# Altium schematic sheet 船主控原理图.schdoc
size 562 x 403 mm
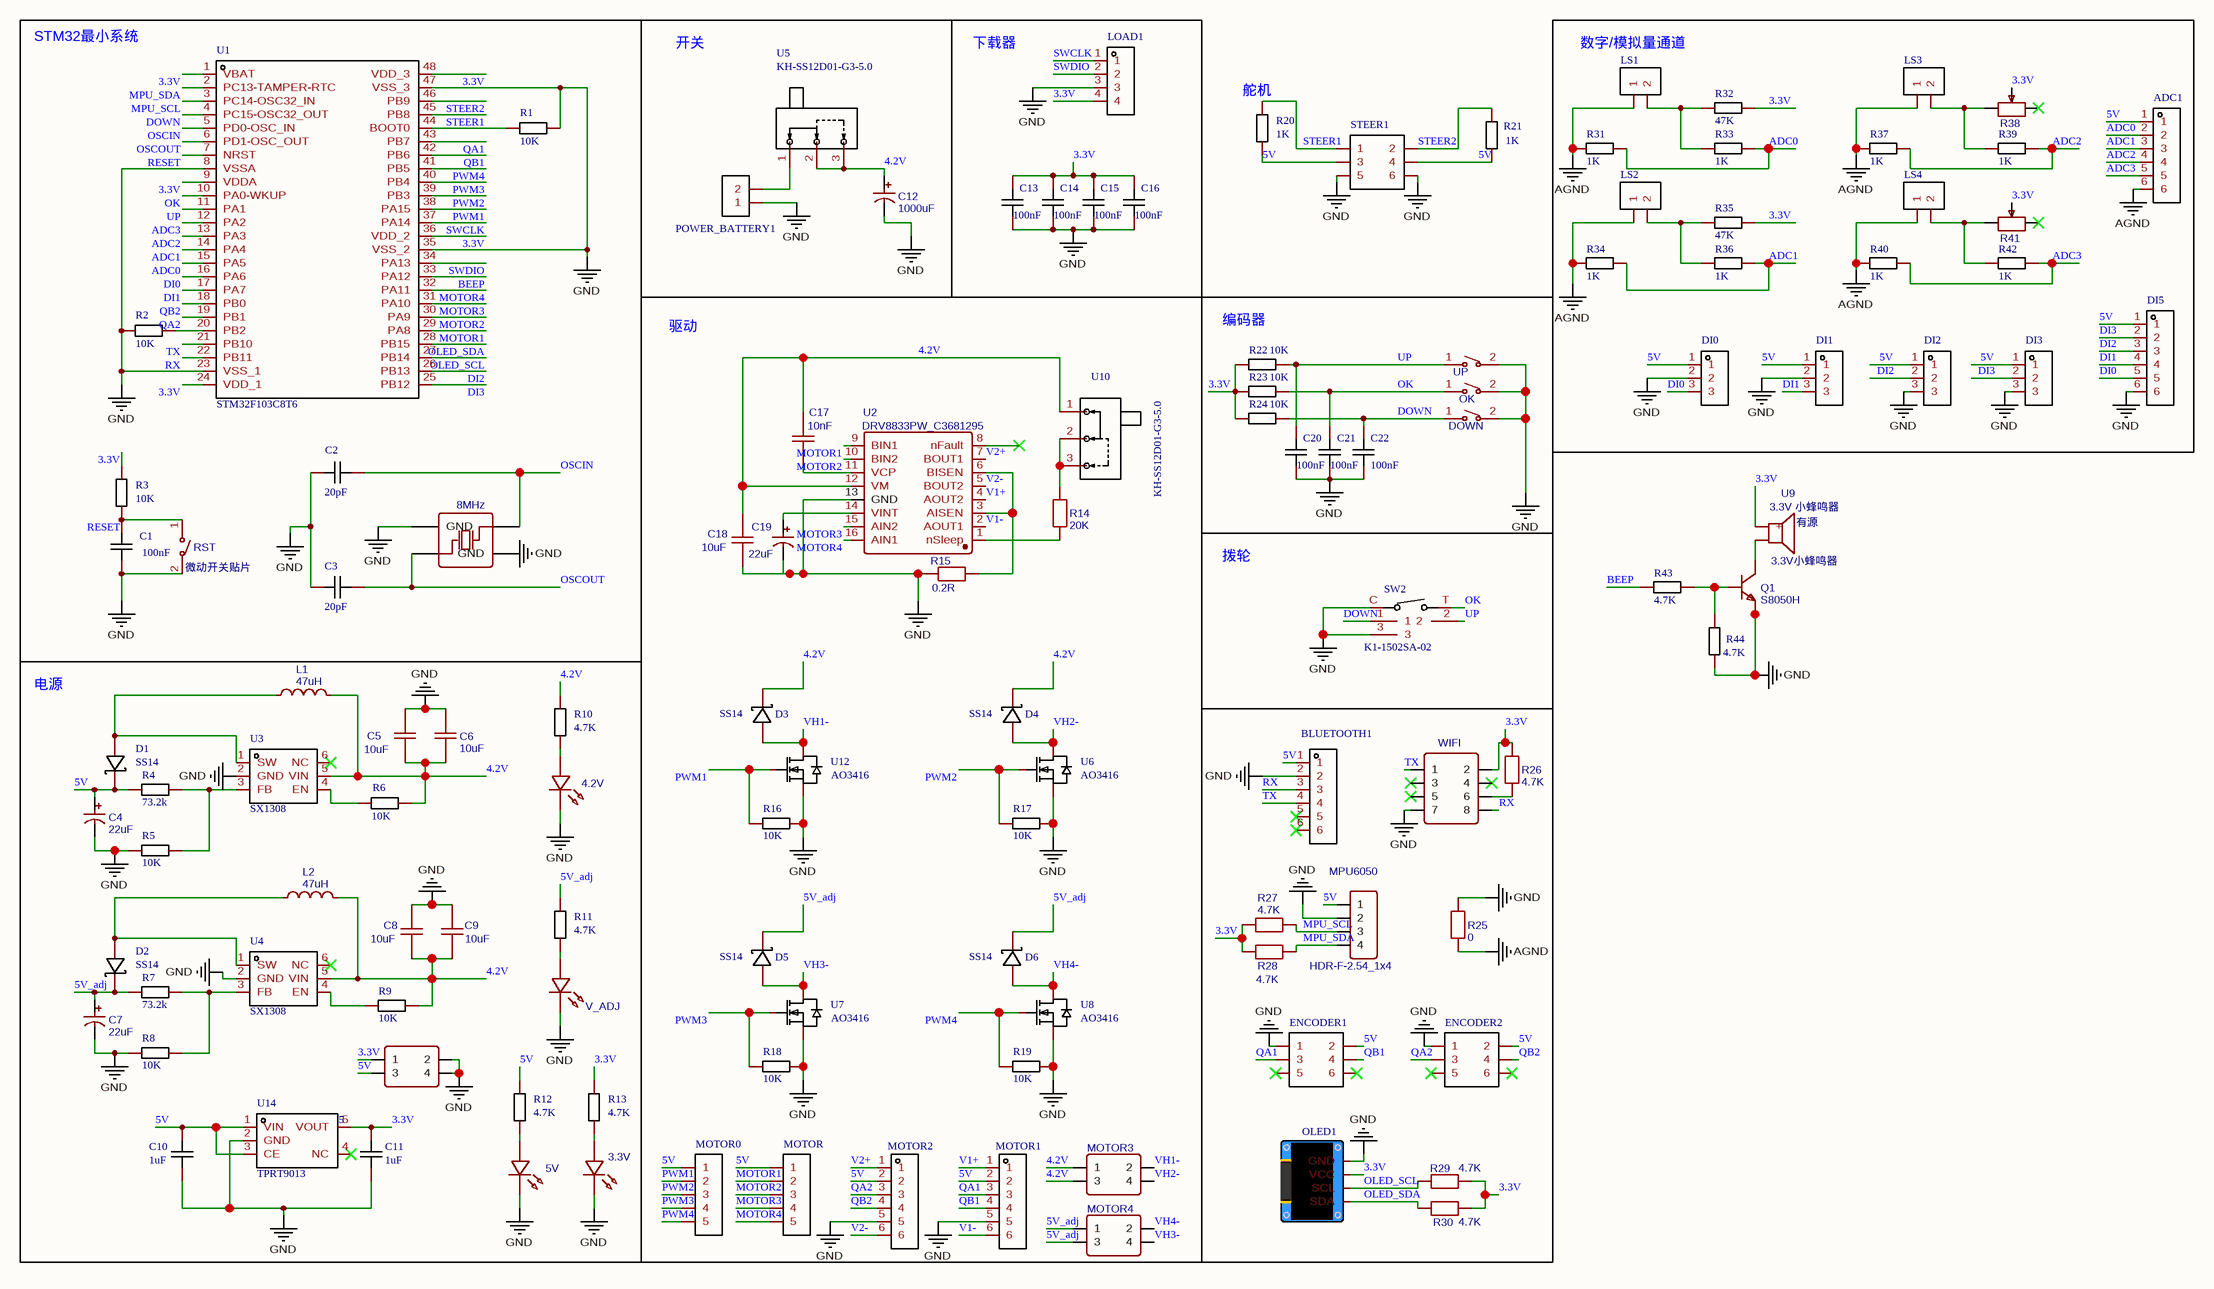
[diagram p0: 船主控原理图.schdoc]

## Parts
3.3V  LED-0603_R  [LED0603_RED]  (value not drawn)
4.2V  LED-0603_R  [LED0603_RED]  (value not drawn)
5V  LED-0603_R  [LED0603_RED]  (value not drawn)
ADC1  HDR-F_2.54_1x6P  [HDR-TH_6P-P2.54-V-F]  (value not drawn)
BLUETOOTH1  HDR-F_2.54_1x6P  [HDR-TH_6P-P2.54-V-F]  (value not drawn)
C1  100nF  [C0603]  (value not drawn)
C2  100nF  [C0603]  (value not drawn)
C3  100nF  [C0603]  (value not drawn)
C4  22uF  [CASE-A_3216]
C5  10uF  [C0805]
C6  10uF  [C0805]
C7  22uF  [CASE-A_3216]
C8  10uF  [C0805]
C9  10uF  [C0805]
C10  1uF  [C0603]  (value not drawn)
C11  1uF  [C0603]  (value not drawn)
C12  1000uF  [CAP-TH_BD8.0-P3.50-D0.6-FD]
C13  100nF  [C0603]  (value not drawn)
C14  100nF  [C0603]  (value not drawn)
C15  100nF  [C0603]  (value not drawn)
C16  100nF  [C0603]  (value not drawn)
C17  10nF  [C0603]
C18  10uF  [C0603]
C19  22uF  [CASE-A_3216]
C20  100nF  [C0603]  (value not drawn)
C21  100nF  [C0603]  (value not drawn)
C22  100nF  [C0603]  (value not drawn)
D1  SS14  [SMA_L4.3-W2.6-LS5.2-RD]  (value not drawn)
D2  SS14  [SMA_L4.3-W2.6-LS5.2-RD]  (value not drawn)
D3  SS14  [SMA_L4.3-W2.6-LS5.2-RD]  (value not drawn)
D4  SS14  [SMA_L4.3-W2.6-LS5.2-RD]  (value not drawn)
D5  SS14  [SMA_L4.3-W2.6-LS5.2-RD]  (value not drawn)
D6  SS14  [SMA_L4.3-W2.6-LS5.2-RD]  (value not drawn)
DI0  HDR-F_2.54_1x3P  [HDR-TH_3P-P2.54-V-F]  (value not drawn)
DI1  HDR-F_2.54_1x3P  [HDR-TH_3P-P2.54-V-F]  (value not drawn)
DI2  HDR-F_2.54_1x3P  [HDR-TH_3P-P2.54-V-F]  (value not drawn)
DI3  HDR-F_2.54_1x3P  [HDR-TH_3P-P2.54-V-F]  (value not drawn)
DI5  HDR-F_2.54_1x6P  [HDR-TH_6P-P2.54-V-F]  (value not drawn)
DOWN  微动开关贴片  [SW-SMD_L6.0-W3.7-LS8.0]  (value not drawn)
ENCODER1  HDR-F_2.54_2x3  [HDR-TH_6P-P2.54-V-F-R2-C3-S2.54]  (value not drawn)
ENCODER2  HDR-F_2.54_2x3  [HDR-TH_6P-P2.54-V-F-R2-C3-S2.54]  (value not drawn)
H1  HDR-F-2.54_2x2  [HDR-F-2.54_2X2]  (value not drawn)
L1  47uH  [IND-SMD_L7.1-W6.6]
L2  47uH  [IND-SMD_L7.1-W6.6]
LOAD1  HDR-F_2.54_1x4P  [HDR-TH_4P-P2.54-V-F]  (value not drawn)
LS1  HDR-F_2.54_1x2P  [HDR-TH_2P-P2.54-V-F]  (value not drawn)
LS2  HDR-F_2.54_1x2P  [HDR-TH_2P-P2.54-V-F]  (value not drawn)
LS3  HDR-F_2.54_1x2P  [HDR-TH_2P-P2.54-V-F]  (value not drawn)
LS4  HDR-F_2.54_1x2P  [HDR-TH_2P-P2.54-V-F]  (value not drawn)
MOTOR  HDR-F_2.54_1x5P  [HDR-TH_5P-P2.54-V-F]  (value not drawn)
MOTOR0  HDR-F_2.54_1x5P  [HDR-TH_5P-P2.54-V-F]  (value not drawn)
MOTOR1  HDR-F_2.54_1x6P  [HDR-TH_6P-P2.54-V-F]  (value not drawn)
MOTOR2  HDR-F_2.54_1x6P  [HDR-TH_6P-P2.54-V-F]  (value not drawn)
MOTOR3  HDR-F-2.54_2x2  [HDR-F-2.54_2X2]  (value not drawn)
MOTOR4  HDR-F-2.54_2x2  [HDR-F-2.54_2X2]  (value not drawn)
MPU6050  HDR-F-2.54_1x4  [HDR-F-2.54_1X4]
NO1  8MHz  [3225G-4P晶振]
OK  微动开关贴片  [SW-SMD_L6.0-W3.7-LS8.0]  (value not drawn)
OLED1  0.96OLED模块_4P  [0.96OLED_4P]  (value not drawn)
POWER_BATTERY1  HDR-F_2.54_1x2P  [HDR-TH_2P-P2.54-V-F]  (value not drawn)
Q1  S8050H  [SOT-23-3_L3.0-W1.7-P0.95-LS2.9-BR]
R1  10K  [R0603]  (value not drawn)
R2  10K  [R0603]  (value not drawn)
R3  10K  [R0603]  (value not drawn)
R4  3K  [R0603]  (value not drawn)
R5  2K  [R0603]  (value not drawn)
R6  10K  [R0603]  (value not drawn)
R7  1K  [R0603]  (value not drawn)
R8  3K  [R0603]  (value not drawn)
R9  10K  [R0603]  (value not drawn)
R10  4.7K  [R0603]  (value not drawn)
R11  4.7K  [R0603]  (value not drawn)
R12  4.7K  [R0603]  (value not drawn)
R13  4.7K  [R0603]  (value not drawn)
R14  20K  [R0603]
R15  0.2R  [R0603]
R16  10K  [R0603]  (value not drawn)
R17  10K  [R0603]  (value not drawn)
R18  10K  [R0603]  (value not drawn)
R19  10K  [R0603]  (value not drawn)
R20  1K  [R0603]  (value not drawn)
R21  1K  [R0603]  (value not drawn)
R22  10K  [R0603]  (value not drawn)
R23  10K  [R0603]  (value not drawn)
R24  10K  [R0603]  (value not drawn)
R25  0  [R0805]
R26  4.7K  [R0603]
R27  4.7K  [R0603]
R28  4.7K  [R0603]
R29  4.7K  [R0603]
R30  4.7K  [R0603]
R31  1K  [R0603]  (value not drawn)
R32  47K  [R0603]  (value not drawn)
R33  1K  [R0603]  (value not drawn)
R34  1K  [R0603]  (value not drawn)
R35  47K  [R0603]  (value not drawn)
R36  1K  [R0603]  (value not drawn)
R37  1K  [R0603]  (value not drawn)
R38  3296W-2K  [RES-ADJ-TH_3296W]  (value not drawn)
R39  1K  [R0603]  (value not drawn)
R40  1K  [R0603]  (value not drawn)
R41  3296W-2K  [RES-ADJ-TH_3296W]  (value not drawn)
R42  1K  [R0603]  (value not drawn)
R43  1K  [R0603]  (value not drawn)
R44  1K  [R0603]  (value not drawn)
RST  微动开关贴片  [SW-SMD_L6.0-W3.7-LS8.0]
STEER1  HDR-F_2.54_2x3  [HDR-TH_6P-P2.54-V-F-R2-C3-S2.54]  (value not drawn)
SW2  K1-1502SA-02  [KEY-SMD_K1-1502SA-02]  (value not drawn)
U1  STM32F103C8T6  [LQFP-48_L7.0-W7.0-P0.50-LS9.0-BL]  (value not drawn)
U2  DRV8833PW_C3681295  [TSSOP-16_L5.0-W4.4-P0.65-LS6.4-BL]
U3  SX1308  [SOT-23-6_L2.9-W1.6-P0.95-LS2.8-BR]  (value not drawn)
U4  SX1308  [SOT-23-6_L2.9-W1.6-P0.95-LS2.8-BR]  (value not drawn)
U5  KH-SS12D01-G3-5.0  [SW-TH_KH-SS12D01-G3-5.0]  (value not drawn)
U6  AO3416  [SOT-23-3_L2.9-W1.3-P1.90-LS2.4-BR]  (value not drawn)
U7  AO3416  [SOT-23-3_L2.9-W1.3-P1.90-LS2.4-BR]  (value not drawn)
U8  AO3416  [SOT-23-3_L2.9-W1.3-P1.90-LS2.4-BR]  (value not drawn)
U9  3.3V 小蜂鸣器  [3.3V小蜂鸣器]
U10  KH-SS12D01-G3-5.0  [SW-TH_KH-SS12D01-G3-5.0]  (value not drawn)
U12  AO3416  [SOT-23-3_L2.9-W1.3-P1.90-LS2.4-BR]  (value not drawn)
U14  TPRT9013  [SOT-23-5_L2.9-W1.6-P0.95-LS2.8-BL]  (value not drawn)
UP  微动开关贴片  [SW-SMD_L6.0-W3.7-LS8.0]  (value not drawn)
V_ADJ  LED-0603_R  [LED0603_RED]  (value not drawn)
WIFI  HDR-M-2.54_2x4  [HDR-M-2.54_2X4]  (value not drawn)

## Blocks framed on the sheet
STM32最小系统: C1-C3 NO1 R1-R3 RST U1
开关: C12 POWER_BATTERY1 U5
下载器: C13-C16 LOAD1
数字/模拟量通道: ADC1 DI0-DI3 DI5 LS1-LS4 R31-R42
驱动: C17-C19 D3-D6 MOTOR MOTOR0-MOTOR4 R14-R19 U2 U6-U8 U10 U12
编码器: C20-C22 DOWN OK R22-R24 UP
拨轮: SW2
电源: 3.3V 4.2V 5V C4-C11 D1 D2 H1 L1 L2 R4-R13 U3 U4 U14 V_ADJ

## Nets
AGND: ADC1.6 LS1.1 LS2.1 LS3.1 LS4.1 R25.1 R31.1 R34.1 R37.1 R40.1
GND: 3.3V.2 4.2V.2 5V.2 BLUETOOTH1.2 C1.1 C2.1 C3.1 C4.2 C5.2 C6.2 C7.2 C8.2 C9.2 C10.1 C11.1 C12.2 C13.1 C14.1 C15.1 C16.1 C18.1 C19.2 C20.1 C21.2 C22.1 DI0.2 DI1.2 DI2.3 DI3.3 DI5.6 DOWN.2 ENCODER1.1 ENCODER2.1 H1.2 H1.4 LOAD1.3 MOTOR1.5 MOTOR2.5 MPU6050.2 NO1.2(GND) NO1.4(GND) OK.2 OLED1.1(GND) POWER_BATTERY1.1 Q1.2(E) R1.2 R2.1 R5.2 R8.2 R15.1 R16.1 R17.1 R18.1 R19.1 R25.2 R44.1 RST.2 STEER1.5 STEER1.6 SW2.3 SW2.C U1.8(VSSA) U1.23(VSS_1) U1.35(VSS_2) U1.47(VSS_3) U2.13(GND) U3.2(GND) U4.2(GND) U6.2(S) U7.2(S) U8.2(S) U12.2(S) U14.2(GND) UP.2 V_ADJ.2 WIFI.7
3.3V: C11.2 C13.2 C14.2 C15.2 C16.2 H1.1 LOAD1.4 OLED1.2(VCC) R3.2 R13.2 R22.2 R23.2 R24.2 R26.2 R27.1 R28.1 R29.1 R30.1 R32.1 R35.1 R38.2 R41.2 U1.1(VBAT) U1.9(VDDA) U1.24(VDD_1) U1.36(VDD_2) U1.48(VDD_3) U9.1(+) U14.5(VOUT) WIFI.2
4.2V: C5.1 C6.1 C8.1 C9.1 C12.1 C17.2 C18.2 D3.1(K) D4.1(K) L1.2 L2.2 MOTOR3.1 MOTOR3.3 R6.1 R9.1 R10.2 U2.12(VM) U3.5(VIN) U4.5(VIN) U5.2 U5.3 U10.1
5V: ADC1.1 BLUETOOTH1.1 C4.1 C10.2 D1.1(K) DI0.1 DI1.1 DI2.1 DI3.1 DI5.1 ENCODER1.2 ENCODER2.2 H1.3 MOTOR.1 MOTOR0.1 MOTOR1.2 MOTOR2.2 MPU6050.1 R4.2 R12.2 R20.2 R21.2 STEER1.3 STEER1.4 U14.1(VIN) U14.3(CE)
5V_adj: C7.1 D2.1(K) D5.1(K) D6.1(K) MOTOR4.1 MOTOR4.3 R7.2 R11.2
ADC0: ADC1.2 R31.2 R33.2 U1.15(PA5)
ADC1: ADC1.3 R34.2 R36.2 U1.14(PA4)
ADC2: ADC1.4 R37.2 R39.2 U1.13(PA3)
ADC3: ADC1.5 R40.2 R42.2 U1.12(PA2)
BEEP: R43.1 U1.33(PA12)
DI0: DI0.3 DI5.5 U1.16(PA6)
DI1: DI1.3 DI5.4 U1.17(PA7)
DI2: DI2.2 DI5.3 U1.26(PB13)
DI3: DI3.2 DI5.2 U1.25(PB12)
DOWN: C22.2 DOWN.1 R24.1 SW2.1 U1.4(PC15-OSC32_OUT)
MOTOR1: MOTOR.2 U1.29(PA8) U2.9(BIN1)
MOTOR2: MOTOR.3 U1.30(PA9) U2.10(BIN2)
MOTOR3: MOTOR.4 U1.31(PA10) U2.15(AIN2)
MOTOR4: MOTOR.5 U1.32(PA11) U2.16(AIN1)
MPU_SCL: MPU6050.3 R27.2 U1.3(PC14-OSC32_IN)
MPU_SDA: MPU6050.4 R28.2 U1.2(PC13-TAMPER-RTC)
OK: C21.1 OK.1 R23.1 SW2.T U1.10(PA0-WKUP)
OLED_SCL: OLED1.3(SCL) R29.2 U1.27(PB14)
OLED_SDA: OLED1.4(SDA) R30.2 U1.28(PB15)
OSCIN: C2.2 NO1.3(OSC2) U1.5(PD0-OSC_IN)
OSCOUT: C3.2 NO1.1(OSC1) U1.6(PD1-OSC_OUT)
PWM1: MOTOR0.2 R16.2 U1.38(PA15) U12.1(G)
PWM2: MOTOR0.3 R17.2 U1.39(PB3) U6.1(G)
PWM3: MOTOR0.4 R18.2 U1.40(PB4) U7.1(G)
PWM4: MOTOR0.5 R19.2 U1.41(PB5) U8.1(G)
QA1: ENCODER1.3 MOTOR1.3 U1.43(PB7)
QA2: ENCODER2.3 MOTOR2.3 U1.19(PB1)
QB1: ENCODER1.4 MOTOR1.4 U1.42(PB6)
QB2: ENCODER2.4 MOTOR2.4 U1.18(PB0)
RESET: C1.2 R3.1 RST.1 U1.7(NRST)
RX: BLUETOOTH1.3 U1.22(PB11) WIFI.8
STEER1: R20.1 STEER1.1 U1.45(PB8)
STEER2: R21.1 STEER1.2 U1.46(PB9)
SWCLK: LOAD1.1 U1.37(PA14)
SWDIO: LOAD1.2 U1.34(PA13)
TX: BLUETOOTH1.4 U1.21(PB10) WIFI.1
UP: C20.2 R22.1 SW2.2 U1.11(PA1) UP.1
V1+: MOTOR1.1 U2.4(AOUT2)
V1-: MOTOR1.6 U2.2(AOUT1)
V2+: MOTOR2.1 U2.7(BOUT1)
V2-: MOTOR2.6 U2.5(BOUT2)
VH1-: D3.2(A) MOTOR3.2 U12.3(D)
VH2-: D4.2(A) MOTOR3.4 U6.3(D)
VH3-: D5.2(A) MOTOR4.4 U7.3(D)
VH4-: D6.2(A) MOTOR4.2 U8.3(D)
Net3.3V_1: 3.3V.1 R13.1
Net4.2V_1: 4.2V.1 R10.1
Net5V_1: 5V.1 R12.1
NetC17_1: C17.1 U2.11(VCP)
NetC19_1: C19.1 U2.14(VINT)
NetD1_2: D1.2(A) L1.1 U3.1(SW)
NetD2_2: D2.2(A) L2.1 U4.1(SW)
NetLS1_2: LS1.2 R32.2 R33.1
NetLS2_2: LS2.2 R35.2 R36.1
NetLS3_2: LS3.2 R38.3 R39.1
NetLS4_2: LS4.2 R41.3 R42.1
NetPOWER_BATTERY1_2: POWER_BATTERY1.2 U5.1
NetQ1_1: Q1.1(B) R43.2 R44.2
NetQ1_3: Q1.3(C) U9.2
NetR1_1: R1.1 U1.44(BOOT0)
NetR2_2: R2.2 U1.20(PB2)
NetR4_1: R4.1 R5.1 U3.3(FB)
NetR6_2: R6.2 U3.4(EN)
NetR7_1: R7.1 R8.1 U4.3(FB)
NetR9_2: R9.2 U4.4(EN)
NetR11_1: R11.1 V_ADJ.1
NetR14_1: R14.1 U2.1(nSleep)
NetR14_2: R14.2 U10.2 U10.3
NetR15_2: R15.2 U2.3(AISEN) U2.6(BISEN)
NetR26_1: R26.1 WIFI.6

Not connected (* = marked no-connect by the designer): BLUETOOTH1 5* 6*; ENCODER1 5* 6*; ENCODER2 5* 6*; R38 1*; R41 1*; U2 8(nFault)*; U3 6(NC)*; U4 6(NC)*; U14 4(NC)*; WIFI 3* 4* 5*

## Notes on the sheet
- (near R20) 舵机
- (in symbol 1K) 73.2k; 4.7K
- (in symbol 2K) 10K
- (in symbol 3.3V 小蜂鸣器) 有源; 3.3V小蜂鸣器
- (in symbol 3K) 10K; 73.2k
- (in symbol 100nF) 20pF

## Library data of the parts
3.3V 4.2V 5V V_ADJ = LED-0603_R: BOM_Manufacturer: EVERLIGHT(台湾亿光); BOM_Manufacturer Part: 19-217/R6C-AL1M2VY/3T; Contributor: LCEDA_01; BOM_Supplier Part: C72044; BOM_Supplier: LCSC; spicePre: L; spiceSymbolName: LED-0603_R
ADC1 BLUETOOTH1 DI5 MOTOR1 MOTOR2 = HDR-F_2.54_1x6P: Symbol: Header-Female-2.54_1x6; Convert to PCB: yes; Device: HDR-F_2.54_1x6P; Add into BOM: yes; Supplier Part: C40877; Supplier Footprint: 插件
C1-C3 C13-C16 C20-C22 = 100nF: Symbol: CapAcitance; Device: CAP_0603; Convert to PCB: yes; Name: 100nF; Add into BOM: yes; Supplier Footprint: 0603
C4 C7 C19 = 22uF: BOM_Manufacturer: CEC(振华新云); BOM_Manufacturer Part: CA45-A-6.3V-22uF-M; nameAlias: Capacitance; Contributor: LCSC; BOM_Supplier: LCSC; BOM_Supplier Part: C140378; BOM_JLCPCB Part Class: Extended Part; spicePre: C; spiceSymbolName: CA45-A-6.3V-22uF-M
C5 C6 C8 C9 C18 = 10uF: nameAlias: Value(F); Contributor: LCEDA_Lib; spicePre: C
  C5 C6 C8 C9: spiceSymbolName: C_0805_US
  C18: spiceSymbolName: C_0603_US
C10 C11 = 1uF: Symbol: CapAcitance; Device: CAP_0603; Convert to PCB: yes; Name: 1uF; Add into BOM: yes; Supplier Footprint: 0603
C12 = 1000uF: BOM_Manufacturer: CX(承兴); BOM_Manufacturer Part: GR108M016F16RR0VL4FP0; nameAlias: Capacitance; BOM_Supplier: LCSC; BOM_Supplier Part: C43834; BOM_JLCPCB Part Class: Extended Part; spicePre: C; spiceSymbolName: 1000uF 16V绿金 8*16
C17 = 10nF: nameAlias: Value(F); Contributor: LCEDA_Lib; spicePre: C; spiceSymbolName: C_0603_US
D1-D6 = SS14: Manufacturer: onsemi(安森美); Symbol: SS14_C83852; Add into BOM: yes; Reverse Voltage (Vr): 40V; Average Rectified Current (Io): 1A; Forward Voltage (Vf@If): 500mV@1A; Name: SS14; Device: SS14_C83852; LCSC Part Name: 1.0 A 肖特基势垒整流器; Supplier Part: C83852; Manufacturer Part: SS14; Supplier Footprint: SMA(DO-214AC); JLCPCB Part Class: Extended Part; Datasheet: https://atta.szlcsc.com/upload/public/pdf/source/20181222/C83852_041FE29A925F1DAA7D9CB1F1C69076C2.pdf; Supplier: LCSC; Convert to PCB: yes
DI0-DI3 = HDR-F_2.54_1x3P: Symbol: PM254V-11-03-H85; Convert to PCB: yes; Device: HDR-F_2.54_1x3P; Add into BOM: yes; Supplier Part: C541850; Supplier Footprint: 插件
DOWN OK RST UP = 微动开关贴片: BOM_Manufacturer: null; Contributor: LCSC; BOM_Supplier: LCSC; BOM_Supplier Part: C9900003994; BOM_Manufacturer Part: 微动开关贴片; BOM_JLCPCB Part Class: Extended Part; spicePre: K; spiceSymbolName: 微动开关贴片
ENCODER1 ENCODER2 STEER1 = HDR-F_2.54_2x3: Symbol: HDR-F-2.54_2x3; Convert to PCB: yes; Device: HDR-F_2.54_2x3; Add into BOM: yes; Supplier Part: C92272; Supplier Footprint: 插件
H1 MOTOR3 MOTOR4 = HDR-F-2.54_2x2: Contributor: LCEDA_Lib; BOM_Supplier Part: C239342; BOM_Supplier: LCSC; spicePre: H; spiceSymbolName: HDR-F-2.54_2x2
L1 L2 = 47uH: BOM_Manufacturer: null; BOM_Manufacturer Part: CDRH74R-7*7*4MM; Contributor: lcsc; BOM_Supplier: LCSC; BOM_Supplier Part: C9900014391; BOM_JLCPCB Part Class: Extended Part; spicePre: U; spiceSymbolName: CDRH74R-7*7*4MM_C9900014391
LOAD1 = HDR-F_2.54_1x4P: Symbol: 2.54-1*4P母; Convert to PCB: yes; Device: HDR-F_2.54_1x4P; Add into BOM: yes; Supplier Part: C2718488; Supplier Footprint: 插件
LS1-LS4 POWER_BATTERY1 = HDR-F_2.54_1x2P: Symbol: Header-Female-2.54_1x2; Convert to PCB: yes; Device: HDR-F_2.54_1x2P; Add into BOM: yes; Supplier Part: C49661; Supplier Footprint: 插件
MOTOR MOTOR0 = HDR-F_2.54_1x5P: Symbol: Header-Female-2.54_1x5; Convert to PCB: yes; Device: HDR-F_2.54_1x5P; Add into BOM: yes; Supplier Part: C50950; Supplier Footprint: 插件
MPU6050 = HDR-F-2.54_1x4: Contributor: LCEDA_Lib; BOM_Supplier Part: C225501; BOM_Supplier: LCSC; spicePre: H; spiceSymbolName: HDR-F-2.54_1x4
NO1 = 8MHz: BOM_Manufacturer: HeZo; BOM_Manufacturer Part: 8M-3225G封装; nameAlias: Frequency; Contributor: BaoXiWang; BOM_Supplier: HeZo; BOM_Supplier Part: 无源晶振8M-3225; spicePre: X; spiceSymbolName: 无源晶振3225G
OLED1 = 0.96OLED模块_4P: Convert to PCB: yes; Symbol: 0.96OLED模块_4P; Device: 0.96OLED模块_4P; Add into BOM: yes; Supplier Footprint: 插件
Q1 = S8050H: BOM_Manufacturer: Yangzhou Yangjie Elec Tech; Contributor: LCSC; BOM_Supplier: LCSC; BOM_Supplier Part: C388539; BOM_Manufacturer Part: S8050H; BOM_JLCPCB Part Class: Extended Part; spicePre: Q; spiceSymbolName: S8050H
R1-R3 R6 R9 R16-R19 R22-R24 = 10K: Symbol: 电阻; Device: Res_0603; Convert to PCB: yes; Name: 10K; Add into BOM: yes; Supplier Footprint: 0603
R4 R8 = 3K: Symbol: 电阻; Device: Res_0603; Convert to PCB: yes; Name: 3K; Add into BOM: yes; Supplier Footprint: 0603
R5 = 2K: Symbol: 电阻; Device: Res_0603; Convert to PCB: yes; Name: 2K; Add into BOM: yes; Supplier Footprint: 0603
R7 R20 R21 R31 R33 R34 R36 R37 R39 R40 R42-R44 = 1K: Symbol: 电阻; Device: Res_0603; Convert to PCB: yes; Name: 1K; Add into BOM: yes; Supplier Footprint: 0603
R10-R13 = 4.7K: Symbol: 电阻; Device: Res_0603; Convert to PCB: yes; Name: 4.7K; Add into BOM: yes; Supplier Footprint: 0603
R14 = 20K: nameAlias: Value(Ω); Contributor: LCEDA_Lib; spicePre: R; spiceSymbolName: R_0603_EU
R15 = 0.2R: nameAlias: Value(Ω); Contributor: LCEDA_Lib; spicePre: R; spiceSymbolName: R_0603_EU
R25 = 0: nameAlias: Value(Ω); Contributor: LCEDA_Lib; spicePre: R; spiceSymbolName: R_0805_EU
R26-R30 = 4.7K: nameAlias: Value(Ω); Contributor: LCEDA_Lib; spicePre: R; spiceSymbolName: R_0603_EU
R32 R35 = 47K: Symbol: 电阻; Device: Res_0603; Convert to PCB: yes; Name: 47K; Add into BOM: yes; Supplier Footprint: 0603
R38 R41 = 3296W-2K: BOM_Manufacturer: null; Contributor: lcsc; BOM_Supplier: LCSC; BOM_Supplier Part: C9900022608; BOM_Manufacturer Part: 3296W-2K; BOM_JLCPCB Part Class: Extended Part; spicePre: R; spiceSymbolName: 3296W-2K
SW2 = K1-1502SA-02: Manufacturer: 韩国韩荣; Add into BOM: yes; Name: K1-1502SA-02; Symbol: K1-1502SA-02; Device: K1-1502SA-02; LCSC Part Name: 上中下按键三向拨轮开关 11.8mm*11.7mm; Supplier Part: C128929; Manufacturer Part: K1-1502SA-02; Supplier Footprint: SMD-5P,11.7x11.8mm; JLCPCB Part Class: Extended Part; Datasheet: https://atta.szlcsc.com/upload/public/pdf/source/20210810/6E4D76E797EC1584D0EB8D60F77D41D6.pdf; Supplier: LCSC; Convert to PCB: yes
U1 = STM32F103C8T6: Manufacturer: ST(意法半导体); Add into BOM: yes; CPU Core: ARM Cortex-M3; CPU Maximum Speed: 72MHz; Operating Voltage Range: 2V3.6V; Program Storage Size: 64KB; Program Memory Type: FLASH; RAM Size: 20KB; GPIO Ports Number: 37; ADC (Bit): 12bit; Peripheral/Function: 看门狗；DMA；看门狗；片载温度传感器; Internal Oscillator: 有; Name: STM32F103C8T6; Symbol: STM32F103C8T6; Device: STM32F103C8T6; LCSC Part Name: ARM Cortex-M3 72MHz MSL=3; Supplier Part: C8734; Manufacturer Part: STM32F103C8T6; Supplier Footprint: LQFP-48(7x7); JLCPCB Part Class: Basic Part; Datasheet: https://atta.szlcsc.com/upload/public/pdf/source/20220812/8363ACEC51AD55ECEB84799464F7CB85.pdf; Supplier: LCSC; Convert to PCB: yes; EEPROM: 64KB; DAC (Bit): -; PWM (Bit): -; Universal Serial Bus: -; Internal Comparator: -; communication protocol: -; Watchdog: -; Real-Time Clock: -; Infrared Data Association: -; Low-Voltage Detect: -; CCP Capture/Compare: -; Secure Digital Input and Output: -; Direct Memory Access: -; Operating Temperature Range: -40℃+85℃
U2 = DRV8833PW_C3681295: BOM_Manufacturer: TI(德州仪器); Contributor: lcsc; BOM_Supplier: LCSC; BOM_Supplier Part: C3681295; BOM_Manufacturer Part: DRV8833PW; link: https://atta.szlcsc.comnull; spicePre: U; spiceSymbolName: DRV8833PW_C3681295
U3 U4 = SX1308: Manufacturer: SX(硕芯科技); Add into BOM: yes; Function: 升压型; Synchronous Rectification: 否; Number of Outputs: 1; Topology: 升压式; Input Voltage: 2V24V; Output Voltage: 28V; Switching Frequency: 1.2MHz; Name: SX1308; Symbol: SX1308; Device: SX1308; LCSC Part Name: 升压型 Vin=2V24V Vout=28V; Supplier Part: C78162; Manufacturer Part: SX1308; Supplier Footprint: SOT-23-6; JLCPCB Part Class: Extended Part; Datasheet: https://atta.szlcsc.com/upload/public/pdf/source/20160920/1474356679185.pdf; Supplier: LCSC; Convert to PCB: yes; Output Current (Max): -
U5 U10 = KH-SS12D01-G3-5.0: Manufacturer: kinghelm(金航标); Add into BOM: yes; Name: KH-SS12D01-G3-5.0; Symbol: KH-SS12D01-G3-5.0; Device: KH-SS12D01-G3-5.0; LCSC Part Name: 拨动开关 KH-SS12D01-G3-5.0针(SS12D00); Supplier Part: C5274456; Manufacturer Part: KH-SS12D01-G3-5.0; Supplier Footprint: 插件; Datasheet: https://atta.szlcsc.com/upload/public/pdf/source/20221118/89F8282F9CF9F25DF0FDDB8FDD97EC5C.pdf; Supplier: LCSC; Convert to PCB: yes
U6-U8 U12 = AO3416: Manufacturer: BORN(伯恩半导体); Symbol: AO3416_C5148471; Add into BOM: yes; Name: AO3416; Device: AO3416_C5148471; LCSC Part Name: AO3416; Supplier Part: C5148471; Manufacturer Part: AO3416; Supplier Footprint: SOT-23; Datasheet: https://atta.szlcsc.com/upload/public/pdf/source/20220830/1599AE97263505341A904D5F65C0D6C6.pdf; Supplier: LCSC; Convert to PCB: yes
U9 = 3.3V 小蜂鸣器: Contributor: oyhoyh; Package Display: Yes; spicePre: U; spiceSymbolName: 3.3V 小蜂鸣器
U14 = TPRT9013: Manufacturer: TECH PUBLIC(台舟); Symbol: TPRT9013-25GB; Add into BOM: yes; NUMBER: 5; Name: TPRT9013; Device: TPRT9013-25GB; LCSC Part Name: TPRT9013-25GB; Supplier Part: C2827656; Manufacturer Part: TPRT9013; Supplier Footprint: SOT-23-5; JLCPCB Part Class: Extended Part; Datasheet: https://atta.szlcsc.com/upload/public/pdf/source/20210427/C2827656_537B5C4061915C8CF287DD06817289A2.pdf; Supplier: LCSC; Convert to PCB: yes; Output Type: -
WIFI = HDR-M-2.54_2x4: Contributor: LCEDA_Lib; BOM_Supplier Part: C58363; BOM_Supplier: LCSC; spicePre: J; spiceSymbolName: HDR-M-2.54_2x4